# Altium project SM2200_PCB.PrjPCB
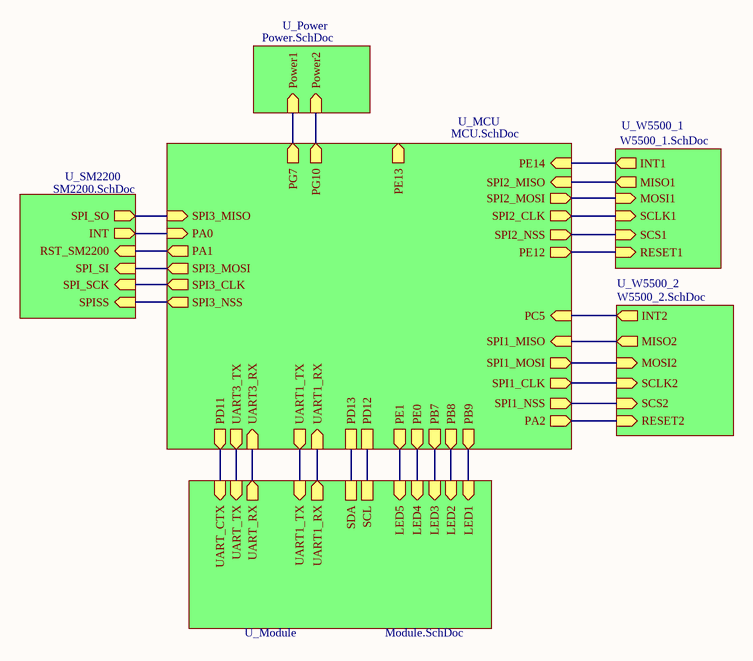
[diagram p0: Top.SchDoc]
7 sheets, 308 parts. Net scope: hierarchical (ports join the sheet entries above them; power ports are global).
Board file: BoardM.PcbDoc
Sheets:
  Top.SchDoc
    U_Module = Module.SchDoc
    U_SM2200 = SM2200.SchDoc
    U_Power = Power.SchDoc
    U_MCU = MCU.SchDoc
    U_W5500_1 = W5500_1.SchDoc
    U_W5500_2 = W5500_2.SchDoc

## Sheet Top.SchDoc
size A4

### Sub-sheets
U_MCU = MCU.SchDoc: SPI1_NSS (out), SPI1_CLK (out), SPI1_MISO (in), SPI1_MOSI (out), SPI2_NSS (out), SPI2_CLK (out), SPI2_MISO (in), SPI2_MOSI (out), PC5 (in), PE14 (in), PE13 (out), PE12 (out), PA2 (out), PA1 (out), PA0 (in), UART1_TX (out), UART1_RX (in), UART3_TX (out), UART3_RX (in), PD11 (out), PD13, PD12, PG7 (out), PG10 (out), PE1 (out), PE0 (out), PB9 (out), PB8 (out), PB7 (out), SPI3_CLK (out), SPI3_MOSI (out), SPI3_NSS (out), SPI3_MISO (in)
U_Module = Module.SchDoc: UART_RX (out), UART_TX (in), UART_CTX (in), SCL, SDA, UART1_TX (in), UART1_RX (out), LED1 (in), LED2 (in), LED3 (in), LED4 (in), LED5 (in)
U_Power = Power.SchDoc: Power1 (in), Power2 (in)
U_SM2200 = SM2200.SchDoc: SPISS (in), SPI_SCK (in), SPI_SI (in), SPI_SO (out), RST_SM2200 (in), INT (out)
U_W5500_1 = W5500_1.SchDoc: RESET1 (in), INT1 (out), SCS1 (in), SCLK1 (in), MOSI1 (in), MISO1 (out)
U_W5500_2 = W5500_2.SchDoc: RESET2 (in), INT2 (out), SCS2 (in), SCLK2 (in), MOSI2 (in), MISO2 (out)

### Nets
INT: sheet U_SM2200/INT, sheet U_MCU/PA0
RST_SM2200: sheet U_SM2200/RST_SM2200, sheet U_MCU/PA1
SPI1_CLK: sheet U_MCU/SPI1_CLK, sheet U_W5500_2/SCLK2
SPI1_MISO: sheet U_MCU/SPI1_MISO, sheet U_W5500_2/MISO2
SPI1_MOSI: sheet U_MCU/SPI1_MOSI, sheet U_W5500_2/MOSI2
SPI1_NSS: sheet U_MCU/SPI1_NSS, sheet U_W5500_2/SCS2
SPI2_CLK: sheet U_MCU/SPI2_CLK, sheet U_W5500_1/SCLK1
SPI2_MISO: sheet U_MCU/SPI2_MISO, sheet U_W5500_1/MISO1
SPI2_MOSI: sheet U_MCU/SPI2_MOSI, sheet U_W5500_1/MOSI1
SPI2_NSS: sheet U_MCU/SPI2_NSS, sheet U_W5500_1/SCS1
SPI3_CLK: sheet U_SM2200/SPI_SCK, sheet U_MCU/SPI3_CLK
SPI3_MISO: sheet U_SM2200/SPI_SO, sheet U_MCU/SPI3_MISO
SPI3_MOSI: sheet U_SM2200/SPI_SI, sheet U_MCU/SPI3_MOSI
SPI3_NSS: sheet U_SM2200/SPISS, sheet U_MCU/SPI3_NSS
NetR11_1: sheet U_MCU/PE14, sheet U_W5500_1/INT1
NetR12_2: sheet U_MCU/PE12, sheet U_W5500_1/RESET1
NetR31_1: sheet U_MCU/PC5, sheet U_W5500_2/INT2
NetR32_2: sheet U_MCU/PA2, sheet U_W5500_2/RESET2
NetR74_2: sheet U_Power/Power2, sheet U_MCU/PG10
NetR75_2: sheet U_Power/Power1, sheet U_MCU/PG7
NetR79_2: sheet U_Module/LED5, sheet U_MCU/PE1
NetR81_1: sheet U_Module/UART1_RX, sheet U_MCU/UART1_RX
NetR82_1: sheet U_Module/UART1_TX, sheet U_MCU/UART1_TX
NetR83_2: sheet U_Module/LED1, sheet U_MCU/PB9
NetR84_2: sheet U_Module/LED2, sheet U_MCU/PB8
NetR85_2: sheet U_Module/LED4, sheet U_MCU/PE0
NetR86_2: sheet U_Module/LED3, sheet U_MCU/PB7
NetR91_1: sheet U_Module/UART_TX, sheet U_MCU/UART3_TX
NetR94_2: sheet U_Module/UART_CTX, sheet U_MCU/PD11
NetR96_2: sheet U_Module/SDA, sheet U_MCU/PD13
NetR98_1: sheet U_Module/UART_RX, sheet U_MCU/UART3_RX
NetR100_2: sheet U_Module/SCL, sheet U_MCU/PD12

## Sheet Module.SchDoc
size A4
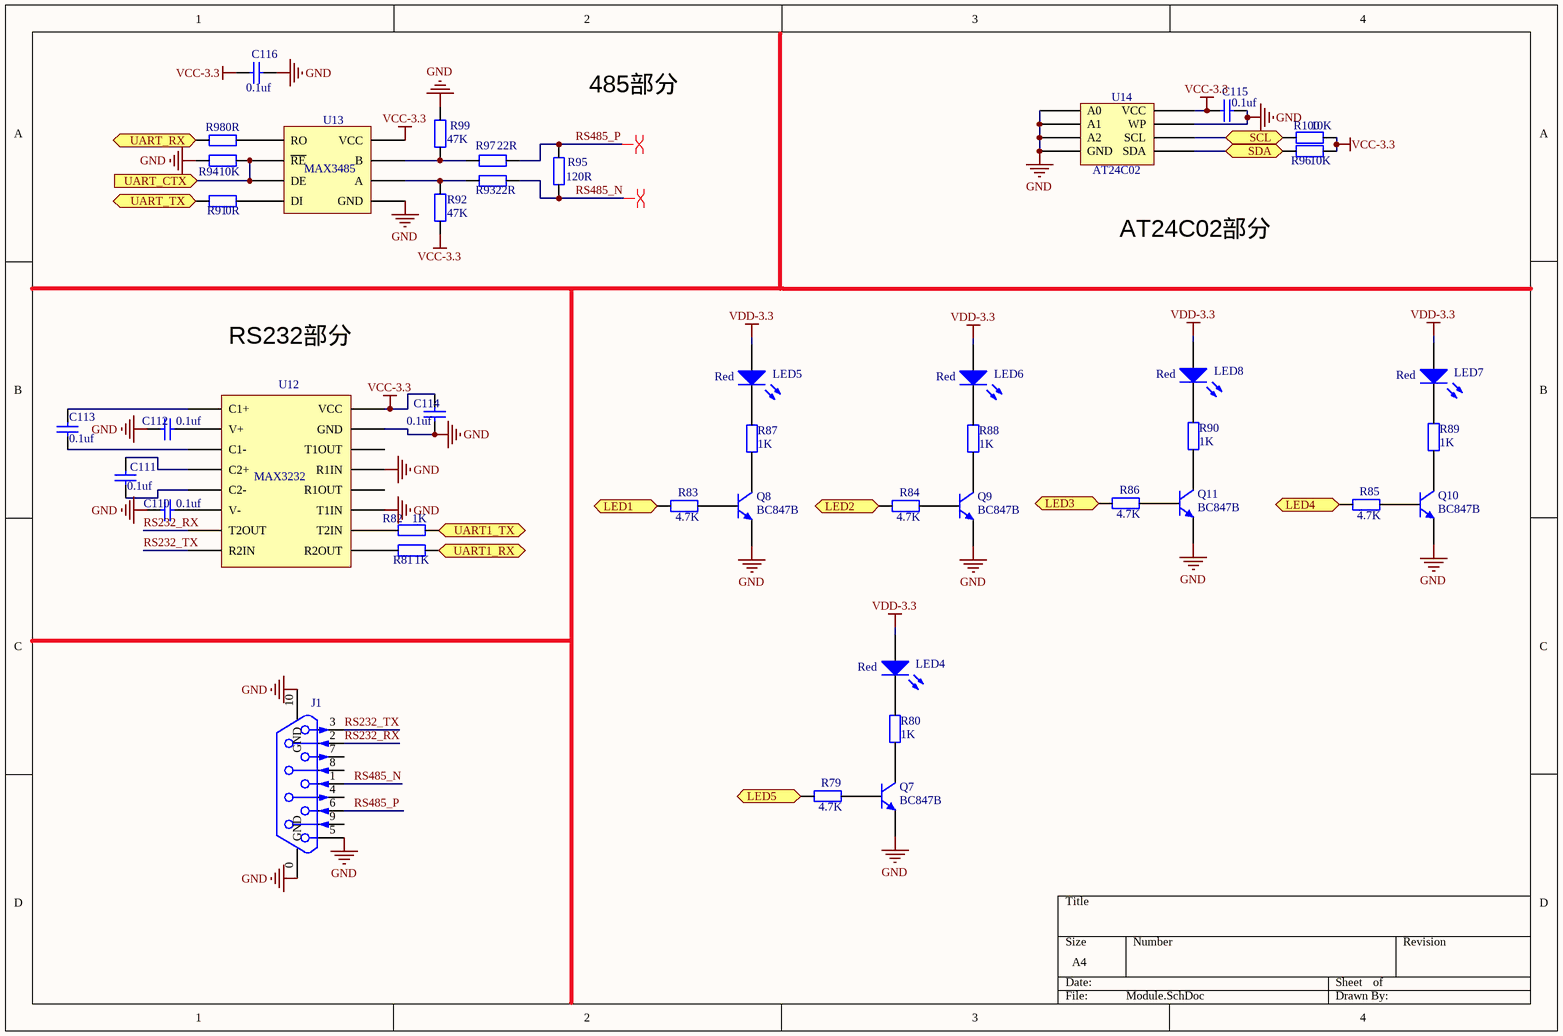
[diagram p1: Module.SchDoc]

### Parts
C110  value 0.1uf  [0603]  (hidden comment: Capacitor-0603)
C111  value 0.1uf  [0603]  (hidden comment: Capacitor-0603)
C112  value 0.1uf  [0603]  (hidden comment: Capacitor-0603)
C113  value 0.1uf  [0603]  (hidden comment: Capacitor-0603)
C114  value 0.1uf  [0603]  (hidden comment: Capacitor-0603)
C115  value 0.1uf  [0603]  (hidden comment: Capacitor-0603)
C116  value 0.1uf  [0603]  (hidden comment: Capacitor-0603)
J1  DB9  [DB9]  (value not drawn)
LED4  Color: Red  [外插小灯]  (hidden comment: LED)
LED5  Color: Red  [外插小灯]  (hidden comment: LED)
LED6  Color: Red  [外插小灯]  (hidden comment: LED)
LED7  Color: Red  [外插小灯]  (hidden comment: LED)
LED8  Color: Red  [外插小灯]  (hidden comment: LED)
Q7  BC847  [BC847B]  (value not drawn)
Q8  BC847  [BC847B]  (value not drawn)
Q9  BC847  [BC847B]  (value not drawn)
Q10  BC847  [BC847B]  (value not drawn)
Q11  BC847  [BC847B]  (value not drawn)
R79  value 4.7K  [0603]  (hidden comment: Resistor-0603)
R80  value 1K  [0603]  (hidden comment: Resistor-0603)
R81  value 1K  [0603]  (hidden comment: Resistor-0603)
R82  value 1K  [0603]  (hidden comment: Resistor-0603)
R83  value 4.7K  [0603]  (hidden comment: Resistor-0603)
R84  value 4.7K  [0603]  (hidden comment: Resistor-0603)
R85  value 4.7K  [0603]  (hidden comment: Resistor-0603)
R86  value 4.7K  [0603]  (hidden comment: Resistor-0603)
R87  value 1K  [0603]  (hidden comment: Resistor-0603)
R88  value 1K  [0603]  (hidden comment: Resistor-0603)
R89  value 1K  [0603]  (hidden comment: Resistor-0603)
R90  value 1K  [0603]  (hidden comment: Resistor-0603)
R91  value 0R  [0603]  (hidden comment: Resistor-0603)
R92  value 47K  [0603]  (hidden comment: Resistor-0603)
R93  value 22R  [0603]  (hidden comment: Resistor-0603)
R94  value 10K  [0603]  (hidden comment: Resistor-0603)
R95  value 120R  [0603]  (hidden comment: Resistor-0603)
R96  value 10K  [0603]  (hidden comment: Resistor-0603)
R97  value 22R  [0603]  (hidden comment: Resistor-0603)
R98  value 0R  [0603]  (hidden comment: Resistor-0603)
R99  value 47K  [0603]  (hidden comment: Resistor-0603)
R100  value 10K  [0603]  (hidden comment: Resistor-0603)
U12  MAX3232  [MAX3232]
U13  MAX3485  [MAX3485]
U14  AT24C02  [AT24C02]

### Ports
LED1 (in), LED2 (in), LED3 (in), LED4 (in), LED5 (in), SCL, SDA, UART1_RX (out), UART1_TX (in), UART_CTX (in), UART_RX (out), UART_TX (in)

### Nets
GND: C110.2 C112.2 C114.1 C115.1 C116.2 J1.0(GND) J1.5 J1.10(GND) Q7.1(E) Q8.1(E) Q9.1(E) Q10.1(E) Q11.1(E) R94.1 R99.2 U12.11(T1IN) U12.13(R1IN) U12.15(GND) U13.5(GND) U14.1(A0) U14.2(A1) U14.3(A2) U14.4(GND) U14.7(WP)
VCC-3.3: C114.2 C115.2 C116.1 R92.1 R96.1 R100.1 U12.16(VCC) U13.8(VCC) U14.8(VCC)
VDD-3.3: LED4.1(A) LED5.1(A) LED6.1(A) LED7.1(A) LED8.1(A)
RS232_RX: J1.2 U12.7(T2OUT)
RS232_TX: J1.3 U12.8(R2IN)
RS485_N: J1.1 R93.1 R95.2
RS485_P: J1.6 R95.1 R97.1
NetC110_1: C110.1 U12.6(V-)
NetC111_1: C111.1 U12.5(C2-)
NetC111_2: C111.2 U12.4(C2+)
NetC112_1: C112.1 U12.2(V+)
NetC113_1: C113.1 U12.3(C1-)
NetC113_2: C113.2 U12.1(C1+)
NetLED4_2: LED4.2 R80.2
NetLED5_2: LED5.2 R87.2
NetLED6_2: LED6.2 R88.2
NetLED7_2: LED7.2 R89.2
NetLED8_2: LED8.2 R90.2
NetQ7_2: Q7.2(B) R79.1
NetQ7_3: Q7.3(C) R80.1
NetQ8_2: Q8.2(B) R83.1
NetQ8_3: Q8.3(C) R87.1
NetQ9_2: Q9.2(B) R84.1
NetQ9_3: Q9.3(C) R88.1
NetQ10_2: Q10.2(B) R85.1
NetQ10_3: Q10.3(C) R89.1
NetQ11_2: Q11.2(B) R86.1
NetQ11_3: Q11.3(C) R90.1
NetR79_2: R79.2 ; port LED5
NetR81_1: R81.1 ; port UART1_RX
NetR81_2: R81.2 U12.9(R2OUT)
NetR82_1: R82.1 ; port UART1_TX
NetR82_2: R82.2 U12.10(T2IN)
NetR83_2: R83.2 ; port LED1
NetR84_2: R84.2 ; port LED2
NetR85_2: R85.2 ; port LED4
NetR86_2: R86.2 ; port LED3
NetR91_1: R91.1 ; port UART_TX
NetR91_2: R91.2 U13.4(DI)
NetR92_2: R92.2 R93.2 U13.6(A)
NetR94_2: R94.2 U13.2(~{RE}) U13.3(DE) ; port UART_CTX
NetR96_2: R96.2 U14.5(SDA) ; port SDA
NetR97_2: R97.2 R99.1 U13.7(B)
NetR98_1: R98.1 ; port UART_RX
NetR98_2: R98.2 U13.1(RO)
NetR100_2: R100.2 U14.6(SCL) ; port SCL

Not connected (* = marked no-connect by the designer): J1 4 7 8 9; U12 12(R1OUT) 14(T1OUT)

### Layout directives
differential pair: RS485_N, RS485_P

### Notes on the sheet
- 485部分
- AT24C02部分
- RS232部分

### Library data of the parts
LED4-LED8 = LED: Value: LED
Q7-Q11 = BC847: Name: BC847B
U12 = MAX3232: Name: MAX3232
U13 = MAX3485: Name: MAX3485
U14 = AT24C02: Name: AT24C02

## Sheet SM2200.SchDoc
size 406 x 228 mm
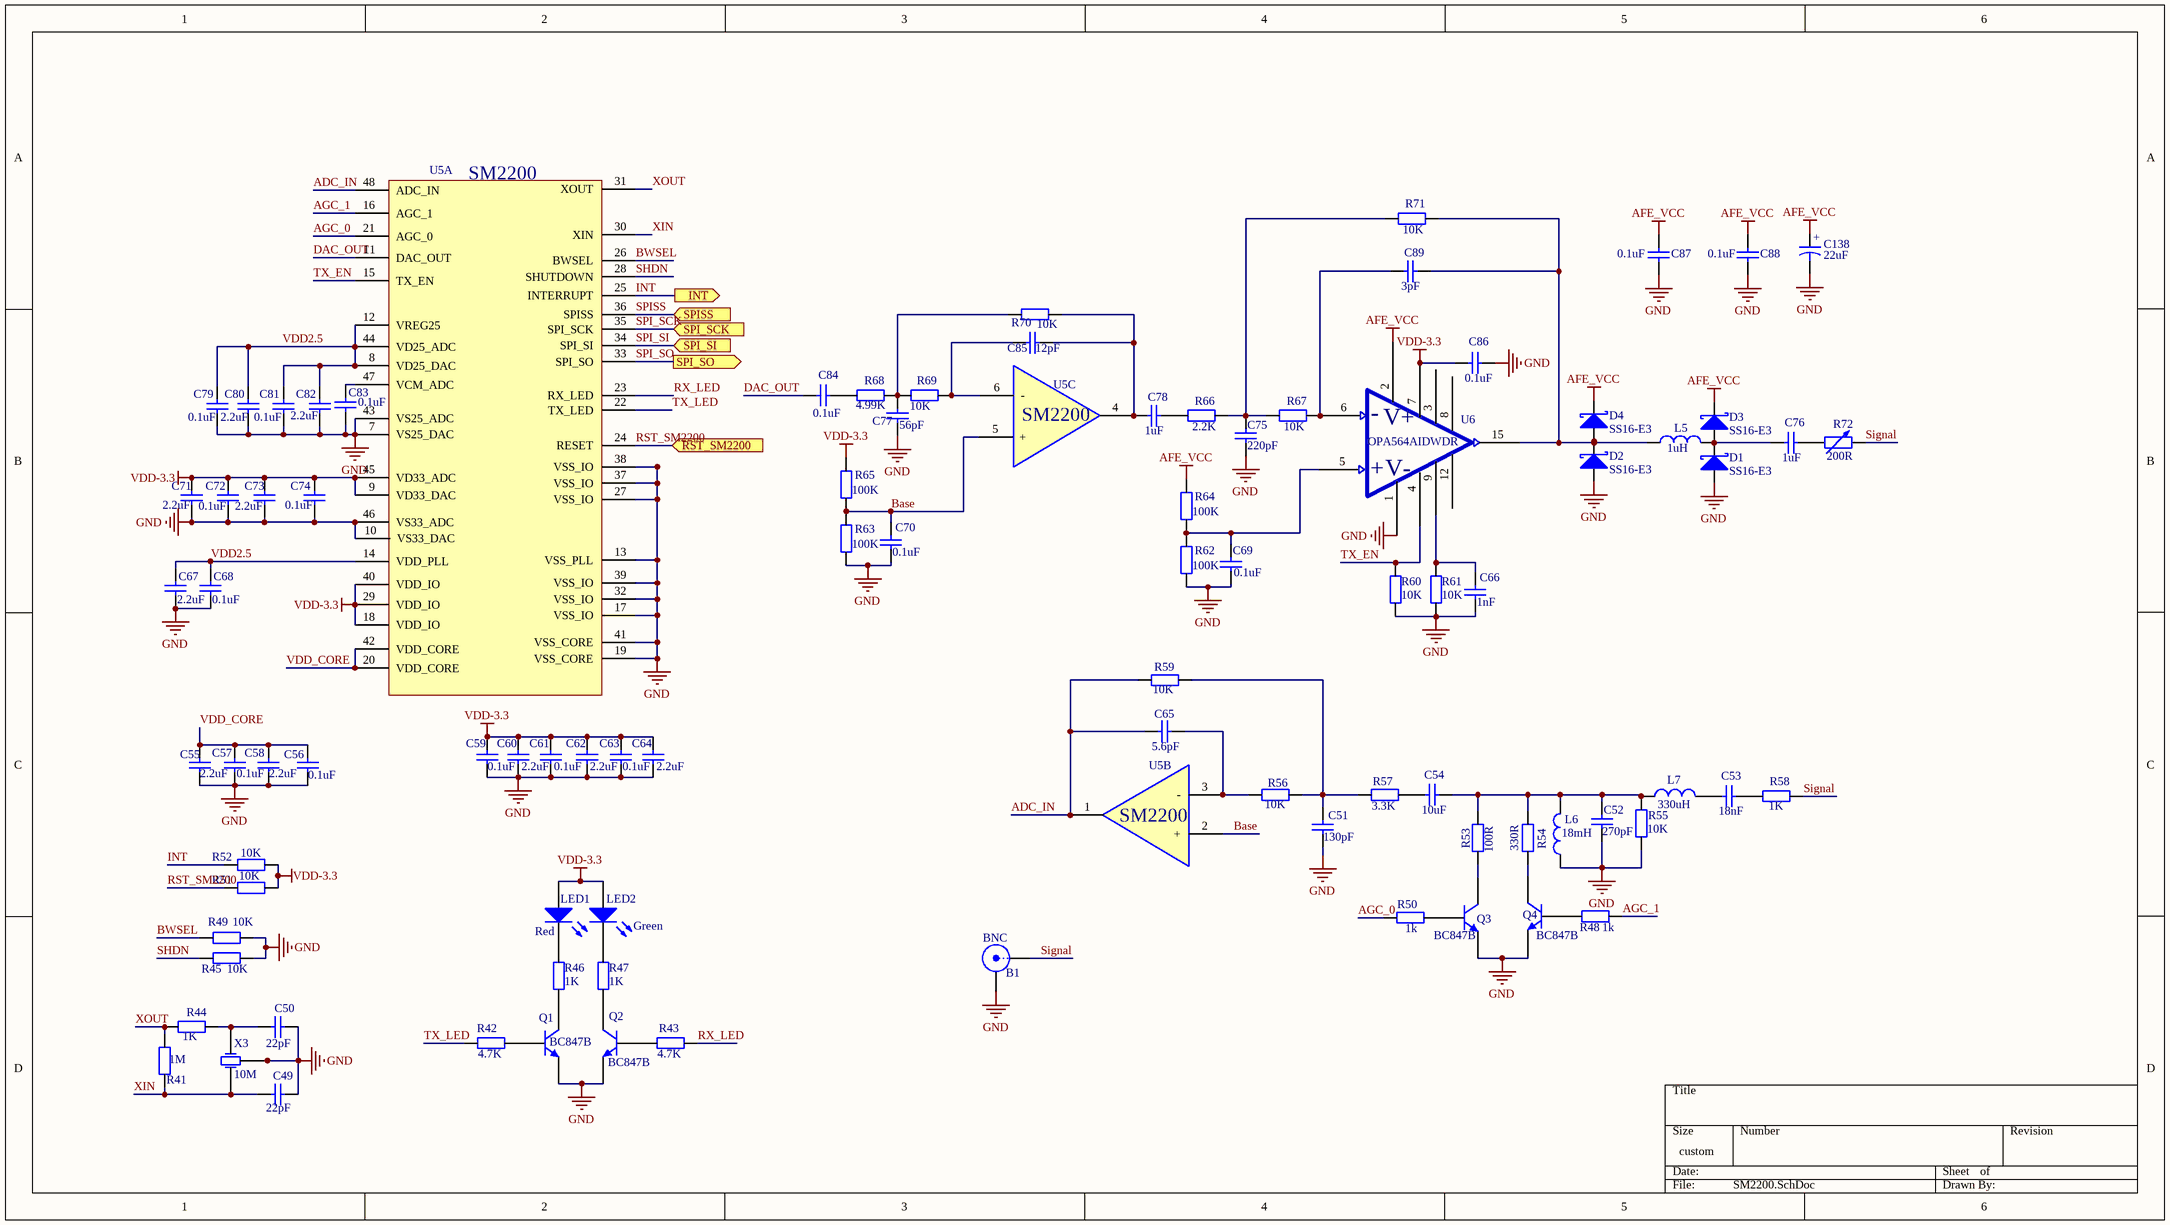
[diagram p2: SM2200.SchDoc]

### Parts
B1  BNC  [BNC]
C49  value 22pF  [0603]  (hidden comment: Capacitor-0805)
C50  value 22pF  [0603]  (hidden comment: Capacitor-0805)
C51  value 130pF  [0603]  (hidden comment: Capacitor-0603)
C52  value 270pF  [0603]  (hidden comment: Capacitor-0603)
C53  value 18nF  [0603]  (hidden comment: Capacitor-0603)
C54  value 10uF  [0805]  (hidden comment: Capacitor-0603)
C55  value 2.2uF  [0603]  (hidden comment: Capacitor-0805)
C56  value 0.1uF  [0603]  (hidden comment: Capacitor-0805)
C57  value 0.1uF  [0603]  (hidden comment: Capacitor-0805)
C58  value 2.2uF  [0603]  (hidden comment: Capacitor-0805)
C59  value 0.1uF  [0603]  (hidden comment: Capacitor-0805)
C60  value 2.2uF  [0603]  (hidden comment: Capacitor-0805)
C61  value 0.1uF  [0603]  (hidden comment: Capacitor-0805)
C62  value 2.2uF  [0603]  (hidden comment: Capacitor-0805)
C63  value 0.1uF  [0603]  (hidden comment: Capacitor-0805)
C64  value 2.2uF  [0603]  (hidden comment: Capacitor-0805)
C65  value 5.6pF  [0603]  (hidden comment: Capacitor-0603)
C66  value 1nF  [0603]  (hidden comment: Capacitor-0603)
C67  value 2.2uF  [0603]  (hidden comment: Capacitor-0805)
C68  value 0.1uF  [0603]  (hidden comment: Capacitor-0805)
C69  value 0.1uF  [0603]  (hidden comment: Capacitor-0603)
C70  value 0.1uF  [0603]  (hidden comment: Capacitor-0603)
C71  value 2.2uF  [0603]  (hidden comment: Capacitor-0805)
C72  value 0.1uF  [0603]  (hidden comment: Capacitor-0805)
C73  value 2.2uF  [0603]  (hidden comment: Capacitor-0805)
C74  value 0.1uF  [0603]  (hidden comment: Capacitor-0805)
C75  value 220pF  [0603]  (hidden comment: Capacitor-0603)
C76  value 1uF  [0603]  (hidden comment: Capacitor-0603)
C77  value 56pF  [0603]  (hidden comment: Capacitor-0603)
C78  value 1uF  [0603]  (hidden comment: Capacitor-0603)
C79  value 0.1uF  [0603]  (hidden comment: Capacitor-0805)
C80  value 2.2uF  [0603]  (hidden comment: Capacitor-0805)
C81  value 0.1uF  [0603]  (hidden comment: Capacitor-0805)
C82  value 2.2uF  [0603]  (hidden comment: Capacitor-0805)
C83  value 0.1uF  [0603]  (hidden comment: Capacitor-0805)
C84  value 0.1uF  [0603]  (hidden comment: Capacitor-0603)
C85  value 12pF  [0603]  (hidden comment: Capacitor-0603)
C86  value 0.1uF  [0603]  (hidden comment: Capacitor-0603)
C87  value 0.1uF  [0603]  (hidden comment: Capacitor-0603)
C88  value 0.1uF  [0603]  (hidden comment: Capacitor-0603)
C89  value 3pF  [0603]  (hidden comment: Capacitor-0603)
C138  value 22uF  [3528]  (hidden comment: 电解电容)
D1  Name: SS16-E3  [IN5824]  (hidden comment: SSA34)
D2  Name: SS16-E3  [IN5824]  (hidden comment: SSA34)
D3  Name: SS16-E3  [IN5824]  (hidden comment: SSA34)
D4  Name: SS16-E3  [IN5824]  (hidden comment: SSA34)
L5  value 1uH  [1206]  (hidden comment: Inductor)
L6  value 18mH  [工字电感0608]  (hidden comment: Inductor)
L7  value 330uH  [Inductor(7.8*7*5)]  (hidden comment: Inductor)
LED1  Color: Red  [外插小灯]  (hidden comment: LED)
LED2  Color: Green  [外插小灯]  (hidden comment: LED)
Q1  BC847  [BC847B]  (value not drawn)
Q2  BC847  [BC847B]  (value not drawn)
Q3  BC847  [BC847B]  (value not drawn)
Q4  BC847  [BC847B]  (value not drawn)
R41  value 1M  [0603]  (hidden comment: Resistor-0805)
R42  value 4.7K  [0603]  (hidden comment: Resistor-0805)
R43  value 4.7K  [0603]  (hidden comment: Resistor-0805)
R44  value 1K  [0603]  (hidden comment: Resistor-0805)
R45  value 10K  [0603]  (hidden comment: Resistor-0805)
R46  value 1K  [0603]  (hidden comment: Resistor-0805)
R47  value 1K  [0603]  (hidden comment: Resistor-0805)
R48  value 1k  [0603]  (hidden comment: Resistor-0603)
R49  value 10K  [0603]  (hidden comment: Resistor-0805)
R50  value 1k  [0603]  (hidden comment: Resistor-0603)
R51  value 10K  [0603]  (hidden comment: Resistor-0805)
R52  value 10K  [0603]  (hidden comment: Resistor-0805)
R53  value 100R  [0603]  (hidden comment: Resistor-0603)
R54  value 330R  [0603]  (hidden comment: Resistor-0603)
R55  value 10K  [0603]  (hidden comment: Resistor-0603)
R56  value 10K  [0603]  (hidden comment: Resistor-0603)
R57  value 3.3K  [0603]  (hidden comment: Resistor-0603)
R58  value 1K  [0603]  (hidden comment: Resistor-0603)
R59  value 10K  [0603]  (hidden comment: Resistor-0603)
R60  value 10K  [0603]  (hidden comment: Resistor-0603)
R61  value 10K  [0603]  (hidden comment: Resistor-0603)
R62  value 100K  [0603]  (hidden comment: Resistor-0603)
R63  value 100K  [0603]  (hidden comment: Resistor-0603)
R64  value 100K  [0603]  (hidden comment: Resistor-0603)
R65  value 100K  [0603]  (hidden comment: Resistor-0603)
R66  value 2.2K  [0603]  (hidden comment: Resistor-0603)
R67  value 10K  [0603]  (hidden comment: Resistor-0603)
R68  value 4.99K  [0603]  (hidden comment: Resistor-0603)
R69  value 10K  [0603]  (hidden comment: Resistor-0603)
R70  value 10K  [0603]  (hidden comment: Resistor-0603)
R71  value 10K  [0603]  (hidden comment: Resistor-0603)
R72  value 200R  [3296电位器]  (hidden comment: Res_)
U5  SM2200  [SM2200]  (parts A,B,C of 3)
U6  OPA564AIDWDR  [OPA564AIDWDR]
X3  value 10M  [3225无源晶振]  (hidden comment: 3225无源晶振)

### Ports
INT (out), RST_SM2200 (in), SPI_SCK (in), SPI_SI (in), SPI_SO (out), SPISS (in)

### Nets
AFE_VCC: C87.2 C88.2 C138.2 D3.2(K) D4.2(K) R64.2 U6.2
GND: B1.1(Y) C49.2 C50.2 C51.2 C52.2 C55.1 C56.1 C57.1 C58.1 C59.1 C60.1 C61.1 C62.1 C63.1 C64.1 C66.1 C67.1 C68.1 C69.2 C70.1 C71.1 C72.1 C73.1 C74.1 C75.2 C77.1 C79.1 C80.1 C81.1 C82.1 C83.1 C86.1 C87.1 C88.1 C138.1 D1.1(A) D2.1(A) L6.1 Q1.1(E) Q2.1(E) Q3.1(E) Q4.1(E) R45.2 R49.2 R55.1 R60.1 R61.1 R62.1 R63.1 U5.7(VS25_DAC) U5.10(VS33_DAC) U5.13(VSS_PLL) U5.17(VSS_IO) U5.19(VSS_CORE) U5.27(VSS_IO) U5.32(VSS_IO) U5.37(VSS_IO) U5.38(VSS_IO) U5.39(VSS_IO) U5.41(VSS_CORE) U5.43(VS25_ADC) U5.46(VS33_ADC) U6.1 X3.2(GND) X3.4(GND)
VDD-3.3: C59.2 C60.2 C61.2 C62.2 C63.2 C64.2 C71.2 C72.2 C73.2 C74.2 C86.2 LED1.1(A) LED2.1(A) R51.2 R52.2 R65.2 U5.9(VD33_DAC) U5.18(VDD_IO) U5.29(VDD_IO) U5.40(VDD_IO) U5.45(VD33_ADC) U6.7
ADC_IN: C65.1 R59.2 U5.1 U5.48(ADC_IN)
AGC_0: R50.2 U5.21(AGC_0)
AGC_1: R48.2 U5.16(AGC_1)
Base: C70.2 R63.2 R65.1 U5.2(+) U5.5(+)
BWSEL: R49.1 U5.26(BWSEL)
DAC_OUT: C84.2 U5.11(DAC_OUT)
INT: R52.1 U5.25(INTERRUPT) ; port INT
RST_SM2200: R51.1 U5.24(RESET) ; port RST_SM2200
RX_LED: R43.1 U5.23(RX_LED)
SHDN: R45.1 U5.28(SHUTDOWN)
Signal: B1.2(X) R58.2 R72.2
SPI_SCK: U5.35(SPI_SCK) ; port SPI_SCK  [project net SPI3_CLK]
SPI_SI: U5.34(SPI_SI) ; port SPI_SI  [project net SPI3_MOSI]
SPI_SO: U5.33(SPI_SO) ; port SPI_SO  [project net SPI3_MISO]
SPISS: U5.36(SPISS) ; port SPISS  [project net SPI3_NSS]
TX_EN: R60.2 U5.15(TX_EN) U6.4
TX_LED: R42.2 U5.22(TX_LED)
VDD2.5: C67.2 C68.2 C79.2 C80.2 C81.2 C82.2 U5.8(VD25_DAC) U5.12(VREG25) U5.14(VDD_PLL) U5.44(VD25_ADC)
VDD_CORE: C55.2 C56.2 C57.2 C58.2 U5.20(VDD_CORE) U5.42(VDD_CORE)
XIN: C49.1 R41.1 U5.30(XIN) X3.1(OSC1)
XOUT: R41.2 R44.1 U5.31(XOUT)
NetC50_1: C50.1 R44.2 X3.3(OSC2)
NetC51_1: C51.1 R56.1 R57.2 R59.1
NetC52_1: C52.1 C54.1 L6.2 L7.1 R53.2 R54.2 R55.2
NetC53_1: C53.1 R58.1
NetC53_2: C53.2 L7.2
NetC54_2: C54.2 R57.1
NetC65_2: C65.2 R56.2 U5.3(-)
NetC66_2: C66.2 R61.2 U6.9
NetC69_1: C69.1 R62.2 R64.1 U6.5
NetC75_1: C75.1 R66.2 R67.1 R71.1
NetC76_1: C76.1 R72.1
NetC76_2: C76.2 D1.2(K) D3.1(A) L5.2
NetC77_2: C77.2 R68.2 R69.1 R70.1
NetC78_1: C78.1 R66.1
NetC78_2: C78.2 C85.1 R70.2 U5.4
NetC83_2: C83.2 U5.47(VCM_ADC)
NetC84_1: C84.1 R68.1
NetC85_2: C85.2 R69.2 U5.6(-)
NetC89_1: C89.1 D2.2(K) D4.1(A) L5.1 R71.2 U6.15
NetC89_2: C89.2 R67.2 U6.6
NetLED1_2: LED1.2 R46.2
NetLED2_2: LED2.2 R47.2
NetQ1_2: Q1.2(B) R42.1
NetQ1_3: Q1.3(C) R46.1
NetQ2_2: Q2.2(B) R43.2
NetQ2_3: Q2.3(C) R47.1
NetQ3_2: Q3.2(B) R50.1
NetQ3_3: Q3.3(C) R53.1
NetQ4_2: Q4.2(B) R48.1
NetQ4_3: Q4.3(C) R54.1

Not connected (* = marked no-connect by the designer): U6 3 8 12

### Notes on the sheet
- (in symbol OPA564AIDWDR) -; V+; +; V-
- (in symbol 电解电容) +

### Library data of the parts
C49 C50 C55-C64 C67 C68 C71-C74 C79-C83 = Capacito
R41-R47 R49 R51 R52 = Resisto
U6 = OPA564AIDWDR: pin to pad: 1>1+10+11+20+13+14; Name: OPA564AIDWDR
B1 = BNC: Name: BNC
LED1 LED2 = LED: Value: LED
Q1-Q4 = BC847: Name: BC847B
R72 = Res_: Name: 3296电位器

## Sheet Power.SchDoc
size A4
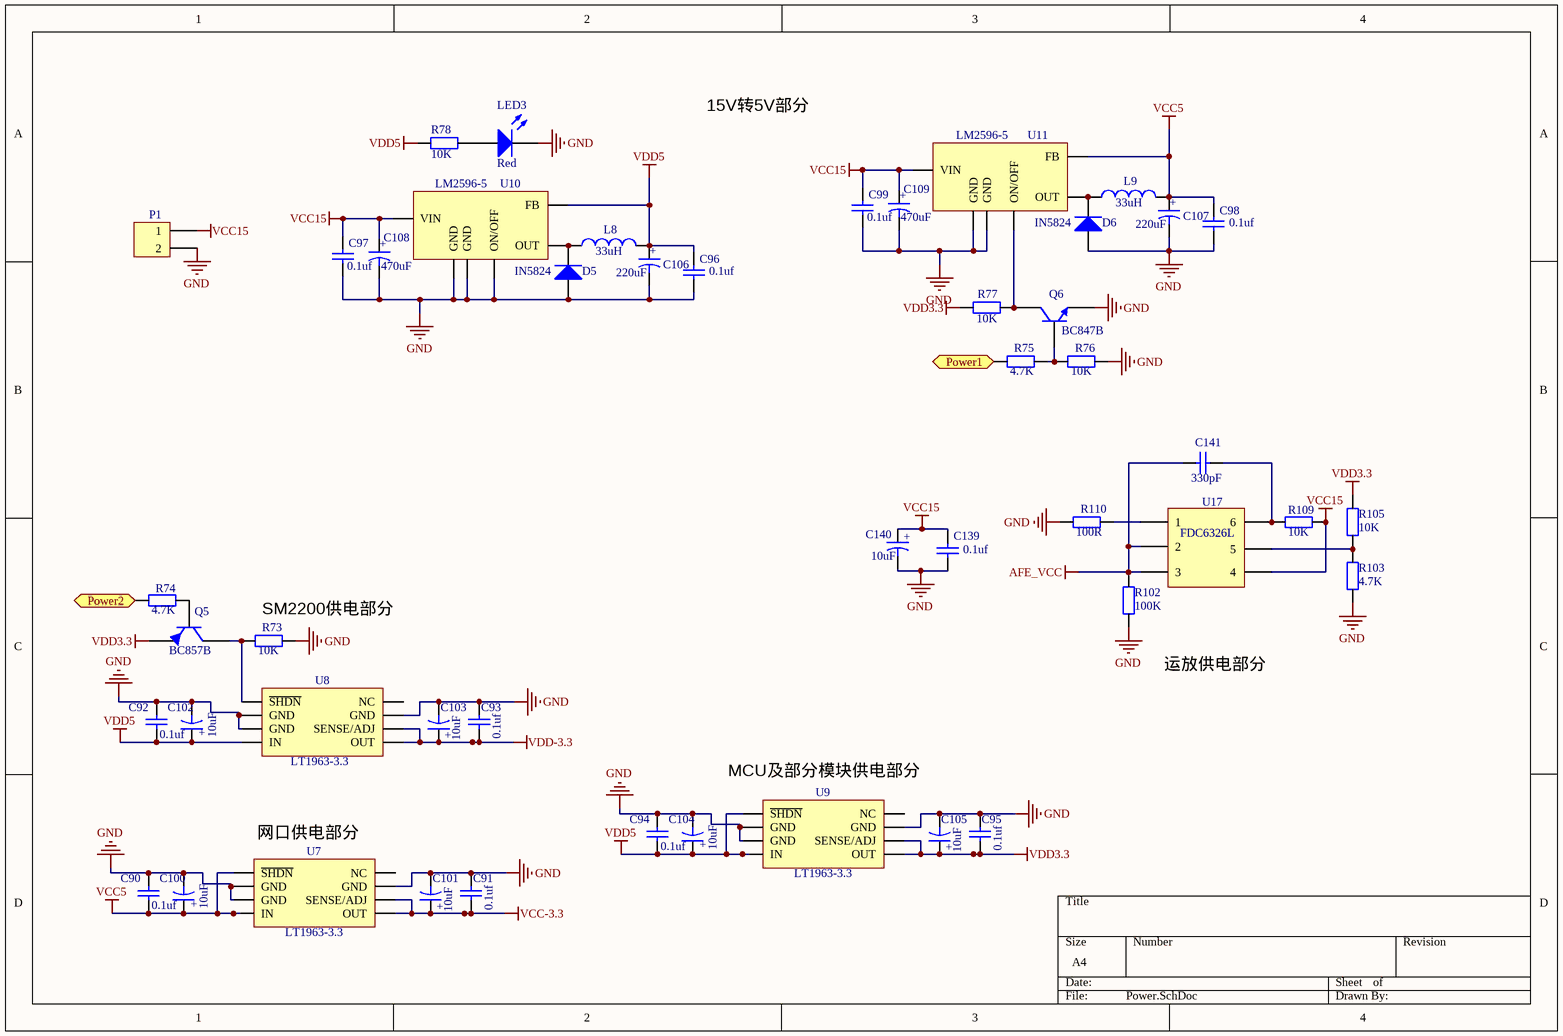
[diagram p3: Power.SchDoc]

### Parts
C90  value 0.1uf  [0805]  (hidden comment: Capacitor-0805)
C91  value 0.1uf  [0805]  (hidden comment: Capacitor-0805)
C92  value 0.1uf  [0805]  (hidden comment: Capacitor-0805)
C93  value 0.1uf  [0805]  (hidden comment: Capacitor-0805)
C94  value 0.1uf  [0805]  (hidden comment: Capacitor-0805)
C95  value 0.1uf  [0805]  (hidden comment: Capacitor-0805)
C96  value 0.1uf  [0805]  (hidden comment: Capacitor-0805)
C97  value 0.1uf  [0805]  (hidden comment: Capacitor-0805)
C98  value 0.1uf  [0805]  (hidden comment: Capacitor-0805)
C99  value 0.1uf  [0805]  (hidden comment: Capacitor-0805)
C100  value 10uF  [钽电容1206（A3216）]  (hidden comment: 电解电容)
C101  value 10uF  [钽电容1206（A3216）]  (hidden comment: 电解电容)
C102  value 10uF  [钽电容1206（A3216）]  (hidden comment: 电解电容)
C103  value 10uF  [钽电容1206（A3216）]  (hidden comment: 电解电容)
C104  value 10uF  [钽电容1206（A3216）]  (hidden comment: 电解电容)
C105  value 10uF  [钽电容1206（A3216）]  (hidden comment: 电解电容)
C106  value 220uF  [贴片铝电容-8*10.3]  (hidden comment: 电解电容)
C107  value 220uF  [贴片铝电容-8*10.3]  (hidden comment: 电解电容)
C108  value 470uF  [贴片铝电容-10*10]  (hidden comment: 电解电容)
C109  value 470uF  [贴片铝电容-10*10]  (hidden comment: 电解电容)
C139  value 0.1uf  [0805]  (hidden comment: Capacitor-0805)
C140  value 10uF  [3528]  (hidden comment: 电解电容)
C141  value 330pF  [0603]  (hidden comment: Capacitor-0805)
D5  IN5824  [IN5824]
D6  IN5824  [IN5824]
L8  value 33uH  [SLF6025   电感]  (hidden comment: Inductor)
L9  value 33uH  [SLF6025   电感]  (hidden comment: Inductor)
LED3  Color: Red  [外插小灯]  (hidden comment: LED)
P1  端子2  [MOLEX-2]  (value not drawn)
Q5  Name: BC857B  [BC847B]  (hidden comment: BC587B)
Q6  BC847  [BC847B]  (value not drawn)
R73  value 10K  [0603]  (hidden comment: Resistor-0603)
R74  value 4.7K  [0603]  (hidden comment: Resistor-0603)
R75  value 4.7K  [0603]  (hidden comment: Resistor-0603)
R76  value 10K  [0603]  (hidden comment: Resistor-0603)
R77  value 10K  [0603]  (hidden comment: Resistor-0603)
R78  value 10K  [0603]  (hidden comment: Resistor-0603)
R102  value 100K  [0603]  (hidden comment: Resistor-0603)
R103  value 4.7K  [0603]  (hidden comment: Resistor-0603)
R105  value 10K  [0603]  (hidden comment: Resistor-0603)
R109  value 10K  [0603]  (hidden comment: Resistor-0603)
R110  value 100R  [0603]  (hidden comment: Resistor-0603)
U7  LT1963  [LT1963]  (value not drawn)
U8  LT1963  [LT1963]  (value not drawn)
U9  LT1963  [LT1963]  (value not drawn)
U10  LM2596  [LM2596]  (value not drawn)
U11  LM2596  [LM2596]  (value not drawn)
U17  FDC6326L  [FDC6326L]

### Ports
Power1 (in), Power2 (in)

### Nets
AFE_VCC: C141.2 R102.2 U17.2 U17.3
GND: C90.2 C91.2 C92.2 C93.2 C94.2 C95.2 C96.1 C97.1 C98.1 C99.1 C100.1 C101.1 C102.1 C103.1 C104.1 C105.1 C106.1 C107.1 C108.1 C109.1 C139.1 C140.1 D5.1(A) D6.1(A) LED3.2 P1.2 Q6.1(E) R73.1 R76.1 R102.1 R103.1 R110.1 U7.3(GND) U7.6(GND) U7.7(GND) U8.3(GND) U8.6(GND) U8.7(GND) U9.3(GND) U9.6(GND) U9.7(GND) U10.3(GND) U10.5(ON/OFF) U10.6(GND) U11.3(GND) U11.6(GND)
VCC5: C90.1 C98.2 C100.2 C107.2 L9.2 U7.5(~{SHDN}) U7.8(IN) U11.4(FB)
VCC15: C97.2 C99.2 C108.2 C109.2 C139.2 C140.2 P1.1 R109.1 U10.1(VIN) U11.1(VIN) U17.4
VCC-3.3: C91.1 C101.2 U7.1(OUT) U7.2(SENSE/ADJ)
VDD3.3: C95.1 C105.2 Q5.1(E) R77.1 R105.2 U9.1(OUT) U9.2(SENSE/ADJ)
VDD5: C92.1 C94.1 C96.2 C102.2 C104.2 C106.2 L8.2 R78.2 U8.8(IN) U9.5(~{SHDN}) U9.8(IN) U10.4(FB)
VDD-3.3: C93.1 C103.2 U8.1(OUT) U8.2(SENSE/ADJ)
NetC141_1: C141.1 R109.2 U17.6
NetD5_2: D5.2(K) L8.1 U10.2(OUT)
NetD6_2: D6.2(K) L9.1 U11.2(OUT)
NetLED3_1: LED3.1(A) R78.1
NetQ5_2: Q5.2(B) R74.1
NetQ5_3: Q5.3(C) R73.2 U8.5(~{SHDN})
NetQ6_2: Q6.2(B) R75.1 R76.2
NetQ6_3: Q6.3(C) R77.2 U11.5(ON/OFF)
NetR74_2: R74.2 ; port Power2
NetR75_2: R75.2 ; port Power1
NetR103_2: R103.2 R105.1 U17.5
NetR110_2: R110.2 U17.1

Not connected (* = marked no-connect by the designer): U7 4(NC); U8 4(NC); U9 4(NC)

### Notes on the sheet
- 15V转5V部分
- (near R73) SM2200供电部分
- 运放供电部分
- (near U9) MCU及部分模块供电部分
- (near U7) 网口供电部分
- (in symbol L) LT1963-3.3; LM2596-5
- (in symbol 电解电容) +

### Library data of the parts
C90-C99 C139 C141 = Capacitor
D5 D6 = I
L8 L9 = Ind
U7-U11 = L
LED3 = LED: Value: LED
Q6 = BC847: Name: BC847B
U17 = FDC6326L: Name: FDC6326L

## Sheet MCU.SchDoc
size A4
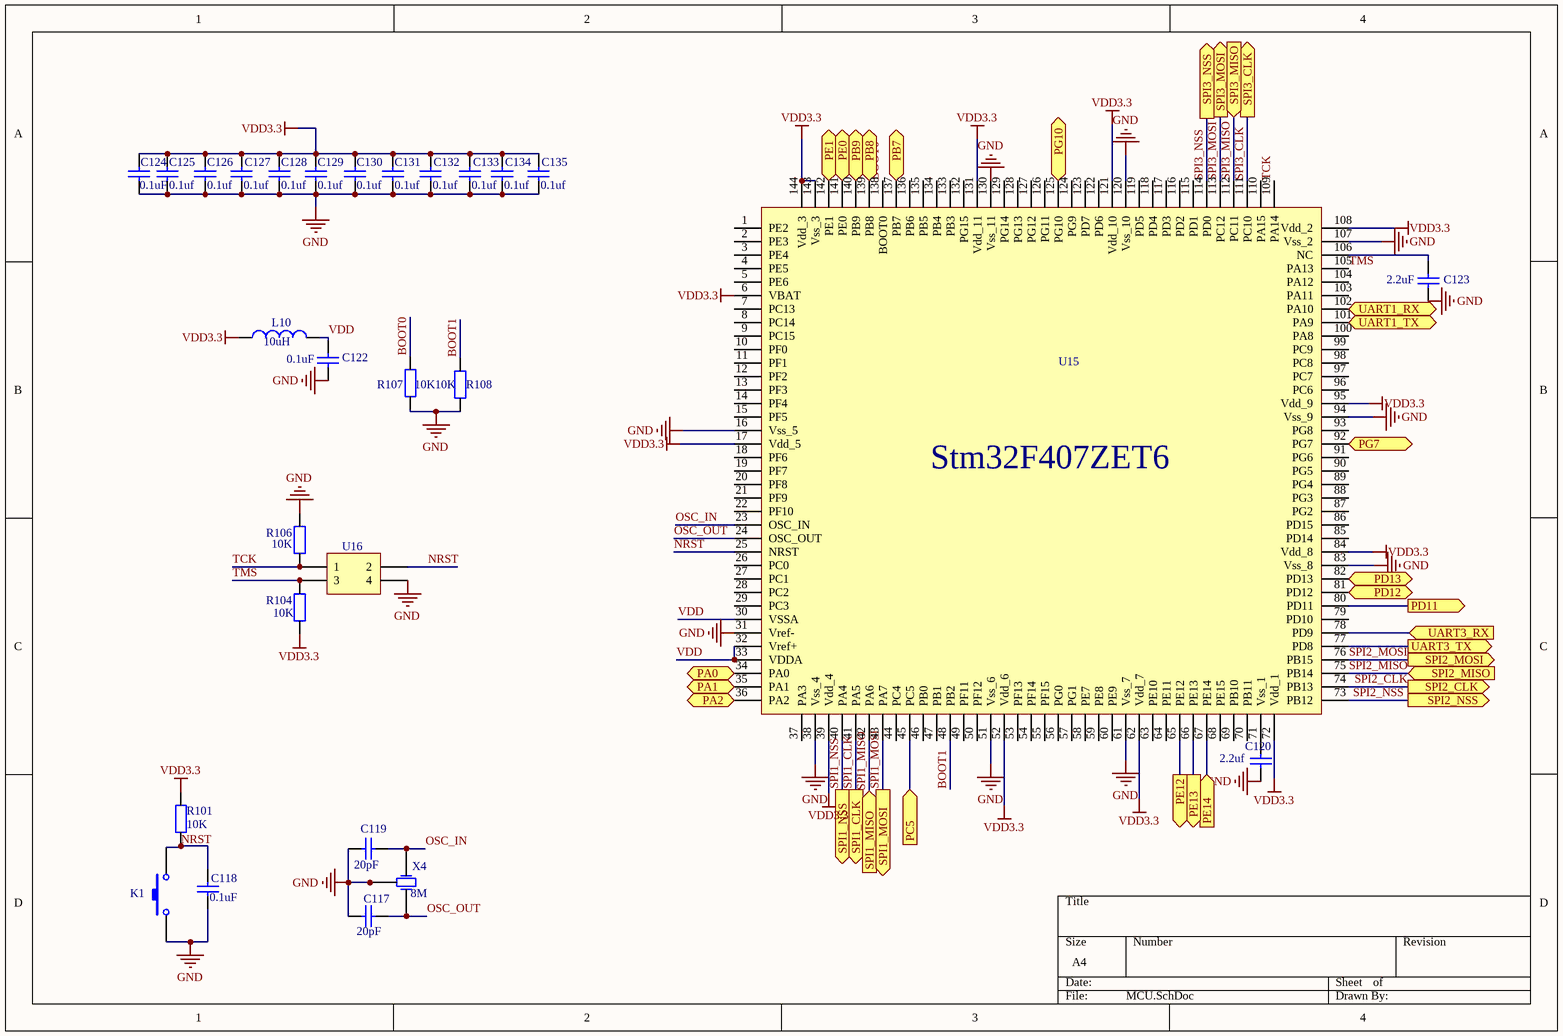
[diagram p4: MCU.SchDoc]

### Parts
C117  value 20pF  [0603]  (hidden comment: Capacitor-0805)
C118  value 0.1uF  [0603]  (hidden comment: Capacitor-0805)
C119  value 20pF  [0603]  (hidden comment: Capacitor-0805)
C120  value 2.2uf  [0603]  (hidden comment: Capacitor-0603)
C122  value 0.1uF  [0603]  (hidden comment: Capacitor-0805)
C123  value 2.2uF  [0603]  (hidden comment: Capacitor-0603)
C124  value 0.1uF  [0603]  (hidden comment: Capacitor-0805)
C125  value 0.1uf  [0603]  (hidden comment: Capacitor-0805)
C126  value 0.1uf  [0603]  (hidden comment: Capacitor-0805)
C127  value 0.1uf  [0603]  (hidden comment: Capacitor-0805)
C128  value 0.1uf  [0603]  (hidden comment: Capacitor-0805)
C129  value 0.1uf  [0603]  (hidden comment: Capacitor-0805)
C130  value 0.1uf  [0603]  (hidden comment: Capacitor-0805)
C131  value 0.1uf  [0603]  (hidden comment: Capacitor-0805)
C132  value 0.1uf  [0603]  (hidden comment: Capacitor-0805)
C133  value 0.1uf  [0603]  (hidden comment: Capacitor-0805)
C134  value 0.1uf  [0603]  (hidden comment: Capacitor-0805)
C135  value 0.1uf  [0603]  (hidden comment: Capacitor-0805)
K1  按键  [贴片按键]  (value not drawn)
L10  value 10uH  [0805]  (hidden comment: Inductor)
R101  value 10K  [0603]  (hidden comment: Resistor-0805)
R104  value 10K  [0603]  (hidden comment: Resistor-0805)
R106  value 10K  [0603]  (hidden comment: Resistor-0805)
R107  value 10K  [0603]  (hidden comment: Resistor-0805)
R108  value 10K  [0603]  (hidden comment: Resistor-0805)
U15  STM32F407ZET6  [Stm32f407ZET6 - duplicate]  (value not drawn)
U16  Header 2X2  [HDR2X2]  (value not drawn)
X4  value 8M  [3225无源晶振]  (hidden comment: 3225无源晶振)

### Ports
PA0 (in), PA1 (out), PA2 (out), PB7 (out), PB8 (out), PB9 (out), PC5 (in), PD11 (out), PD12, PD13, PE0 (out), PE1 (out), PE12 (out), PE13 (out), PE14 (in), PG7 (out), PG10 (out), SPI1_CLK (out), SPI1_MISO (in), SPI1_MOSI (out), SPI1_NSS (out), SPI2_CLK (out), SPI2_MISO (in), SPI2_MOSI (out), SPI2_NSS (out), SPI3_CLK (out), SPI3_MISO (in), SPI3_MOSI (out), SPI3_NSS (out), UART1_RX (in), UART1_TX (out), UART3_RX (in), UART3_TX (out)

### Nets
GND: C117.1 C118.1 C119.1 C120.1 C122.1 C123.1 C124.1 C125.1 C126.1 C127.1 C128.1 C129.1 C130.1 C131.1 C132.1 C133.1 C134.1 C135.1 K1.1 R106.2 R107.1 R108.1 U15.16(Vss_5) U15.31(Vref-) U15.38(Vss_4) U15.51(Vss_6) U15.61(Vss_7) U15.83(Vss_8) U15.94(Vss_9) U15.107(Vss_2) U15.120(Vss_10) U15.130(Vss_11) U16.4 X4.2(GND) X4.4(GND)
VDD3.3: C124.2 C125.2 C126.2 C127.2 C128.2 C129.2 C130.2 C131.2 C132.2 C133.2 C134.2 C135.2 L10.1 R101.2 R104.1 U15.6(VBAT) U15.17(Vdd_5) U15.39(Vdd_4) U15.52(Vdd_6) U15.62(Vdd_7) U15.72(Vdd_1) U15.84(Vdd_8) U15.95(Vdd_9) U15.108(Vdd_2) U15.121(Vdd_10) U15.131(Vdd_11) U15.143(Vss_3) U15.144(Vdd_3)
BOOT0: R107.2 U15.138(BOOT0)
BOOT1: R108.2 U15.48(PB2)
INT: U15.34(PA0) ; port PA0
NRST: C118.2 K1.2 R101.1 U15.25(NRST) U16.2
OSC_IN: C119.2 U15.23(OSC_IN) X4.1(OSC1)
OSC_OUT: C117.2 U15.24(OSC_OUT) X4.3(OSC2)
RST_SM2200: U15.35(PA1) ; port PA1
SPI1_CLK: U15.41(PA5) ; port SPI1_CLK
SPI1_MISO: U15.42(PA6) ; port SPI1_MISO
SPI1_MOSI: U15.43(PA7) ; port SPI1_MOSI
SPI1_NSS: U15.40(PA4) ; port SPI1_NSS
SPI2_CLK: U15.74(PB13) ; port SPI2_CLK
SPI2_MISO: U15.75(PB14) ; port SPI2_MISO
SPI2_MOSI: U15.76(PB15) ; port SPI2_MOSI
SPI2_NSS: U15.73(PB12) ; port SPI2_NSS
SPI3_CLK: U15.111(PC10) ; port SPI3_CLK
SPI3_MISO: U15.112(PC11) ; port SPI3_MISO
SPI3_MOSI: U15.113(PC12) ; port SPI3_MOSI
SPI3_NSS: U15.114(PD0) ; port SPI3_NSS
TCK: R106.1 U15.109(PA14) U16.1
TMS: R104.2 U15.105(PA13) U16.3
VDD: C122.2 L10.2 U15.30(VSSA) U15.32(Vref+) U15.33(VDDA)
NetC120_2: C120.2 U15.71(Vss_1)
NetC123_2: C123.2 U15.106(NC)
NetR11_1: U15.67(PE14) ; port PE14
NetR12_2: U15.65(PE12) ; port PE12
NetR31_1: U15.45(PC5) ; port PC5
NetR32_2: U15.36(PA2) ; port PA2
NetR74_2: U15.125(PG10) ; port PG10
NetR75_2: U15.92(PG7) ; port PG7
NetR79_2: U15.142(PE1) ; port PE1
NetR81_1: U15.102(PA10) ; port UART1_RX
NetR82_1: U15.101(PA9) ; port UART1_TX
NetR83_2: U15.140(PB9) ; port PB9
NetR84_2: U15.139(PB8) ; port PB8
NetR85_2: U15.141(PE0) ; port PE0
NetR86_2: U15.137(PB7) ; port PB7
NetR91_1: U15.77(PD8) ; port UART3_TX
NetR94_2: U15.80(PD11) ; port PD11
NetR96_2: U15.82(PD13) ; port PD13
NetR98_1: U15.78(PD9) ; port UART3_RX
NetR100_2: U15.81(PD12) ; port PD12
NetU15_66: U15.66(PE13) ; port PE13

Not connected (* = marked no-connect by the designer): U15 1(PE2) 2(PE3) 3(PE4) 4(PE5) 5(PE6) 7(PC13) 8(PC14) 9(PC15) 10(PF0) 11(PF1) 12(PF2) 13(PF3) 14(PF4) 15(PF5) 18(PF6) 19(PF7) 20(PF8) 21(PF9) 22(PF10) 26(PC0) 27(PC1) 28(PC2) 29(PC3) 37(PA3) 44(PC4) 46(PB0) 47(PB1) 49(PF11) 50(PF12) 53(PF13) 54(PF14) 55(PF15) 56(PG0) 57(PG1) 58(PE7) 59(PE8) 60(PE9) 63(PE10) 64(PE11) 68(PE15) 69(PB10) 70(PB11) 79(PD10) 85(PD14) 86(PD15) 87(PG2) 88(PG3) 89(PG4) 90(PG5) 91(PG6) 93(PG8) 96(PC6) 97(PC7) 98(PC8) 99(PC9) 100(PA8) 103(PA11) 104(PA12) 110(PA15) 115(PD1) 116(PD2) 117(PD3) 118(PD4) 119(PD5) 122(PD6) 123(PD7) 124(PG9) 126(PG11) 127(PG12) 128(PG13) 129(PG14) 132(PG15) 133(PB3) 134(PB4) 135(PB5) 136(PB6)

### Notes on the sheet
- (in symbol STM32F407Z) Stm32F407ZET6

### Library data of the parts
C117-C119 = Capacitor-0
C122 C124-C135 = Capacitor
L10 = Ind
R101 R104 R106 = Resistor-0
R107 R108 = Resistor
U15 = STM32F407Z: Value: STM32F407ZGT6
U16 = Header 2X2: Header, 2-Pin, Dual row; LatestRevisionDate: 17-Jul-2002; LatestRevisionNote: Re-released for DXP Platform.; Publisher: Altium Limited

## Sheet W5500_1.SchDoc
size A4
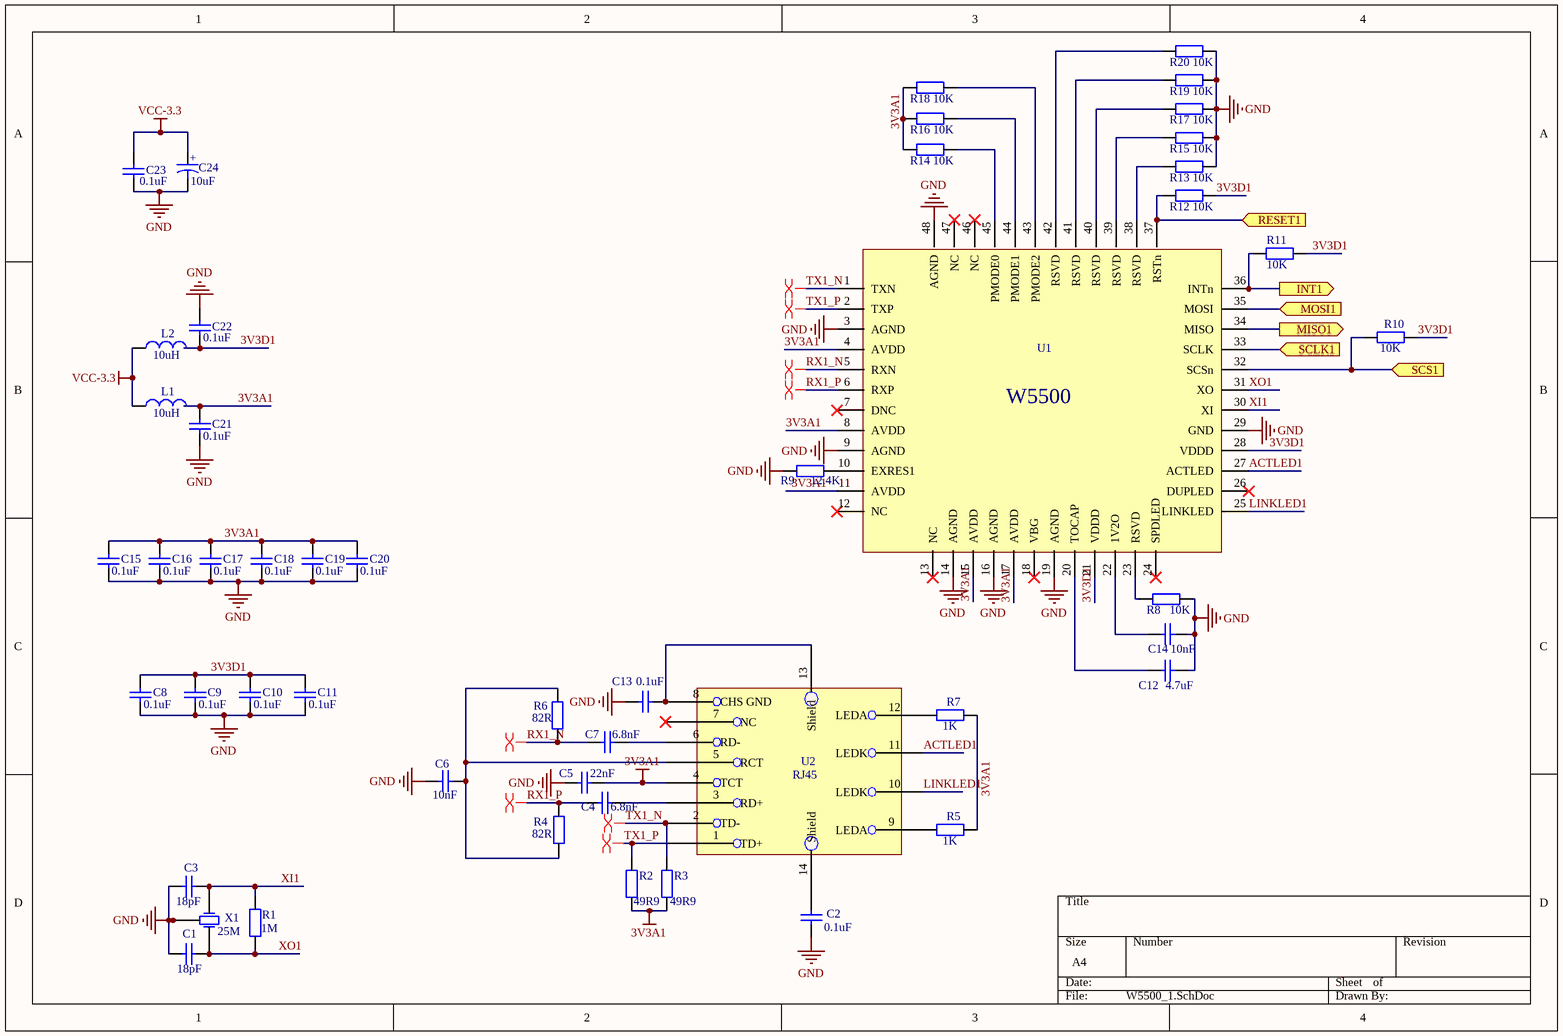
[diagram p5: W5500_1.SchDoc]

### Parts
C1  value 18pF  [0603]  (hidden comment: Capacitor-0603)
C2  value 0.1uF  [0603]  (hidden comment: Capacitor-0603)
C3  value 18pF  [0603]  (hidden comment: Capacitor-0603)
C4  value 6.8nF  [0603]  (hidden comment: Capacitor-0603)
C5  value 22nF  [0603]  (hidden comment: Capacitor-0603)
C6  value 10nF  [0603]  (hidden comment: Capacitor-0603)
C7  value 6.8nF  [0603]  (hidden comment: Capacitor-0603)
C8  value 0.1uF  [0603]  (hidden comment: Capacitor-0603)
C9  value 0.1uF  [0603]  (hidden comment: Capacitor-0603)
C10  value 0.1uF  [0603]  (hidden comment: Capacitor-0603)
C11  value 0.1uF  [0603]  (hidden comment: Capacitor-0603)
C12  value 4.7uF  [0603]  (hidden comment: Capacitor-0805)
C13  value 0.1uF  [0603]  (hidden comment: Capacitor-0603)
C14  value 10nF  [0603]  (hidden comment: Capacitor-0603)
C15  value 0.1uF  [0603]  (hidden comment: Capacitor-0603)
C16  value 0.1uF  [0603]  (hidden comment: Capacitor-0603)
C17  value 0.1uF  [0603]  (hidden comment: Capacitor-0603)
C18  value 0.1uF  [0603]  (hidden comment: Capacitor-0603)
C19  value 0.1uF  [0603]  (hidden comment: Capacitor-0603)
C20  value 0.1uF  [0603]  (hidden comment: Capacitor-0603)
C21  value 0.1uF  [0603]  (hidden comment: Capacitor-0603)
C22  value 0.1uF  [0603]  (hidden comment: Capacitor-0603)
C23  value 0.1uF  [0603]  (hidden comment: Capacitor-0603)
C24  value 10uF  [钽电容1206（A3216）]  (hidden comment: 电解电容)
L1  value 10uH  [0805]  (hidden comment: Inductor)
L2  value 10uH  [0805]  (hidden comment: Inductor)
R1  value 1M  [0603]  (hidden comment: Resistor-0603)
R2  value 49R9  [0603]  (hidden comment: Resistor-0603)
R3  value 49R9  [0603]  (hidden comment: Resistor-0603)
R4  value 82R  [0603]  (hidden comment: Resistor-0603)
R5  value 1K  [0603]  (hidden comment: Resistor-0603)
R6  value 82R  [0603]  (hidden comment: Resistor-0603)
R7  value 1K  [0603]  (hidden comment: Resistor-0603)
R8  value 10K  [0603]  (hidden comment: Resistor-0603)
R9  value 12.4K  [0603]  (hidden comment: Resistor-0603)
R10  value 10K  [0603]  (hidden comment: Resistor-0603)
R11  value 10K  [0603]  (hidden comment: Resistor-0603)
R12  value 10K  [0603]  (hidden comment: Resistor-0603)
R13  value 10K  [0603]  (hidden comment: Resistor-0603)
R14  value 10K  [0603]  (hidden comment: Resistor-0603)
R15  value 10K  [0603]  (hidden comment: Resistor-0603)
R16  value 10K  [0603]  (hidden comment: Resistor-0603)
R17  value 10K  [0603]  (hidden comment: Resistor-0603)
R18  value 10K  [0603]  (hidden comment: Resistor-0603)
R19  value 10K  [0603]  (hidden comment: Resistor-0603)
R20  value 10K  [0603]  (hidden comment: Resistor-0603)
U1  W5500  [W5500]  (value not drawn)
U2  RJ45  [RJ45]
X1  value 25M  [3225无源晶振]  (hidden comment: 3225无源晶振)

### Ports
INT1 (out), MISO1 (out), MOSI1 (in), RESET1 (in), SCLK1 (in), SCS1 (in)

### Nets
3V3A1: C5.2 C15.1 C16.1 C17.1 C18.1 C19.1 C20.1 C21.1 L1.2 R2.2 R3.2 R5.2 R7.2 R14.2 R16.2 R18.2 U1.4(AVDD) U1.8(AVDD) U1.11(AVDD) U1.15(AVDD) U1.17(AVDD) U2.4(TCT)
GND: C1.1 C2.2 C3.1 C5.1 C6.1 C8.2 C9.2 C10.2 C11.2 C12.2 C13.2 C14.1 C15.2 C16.2 C17.2 C18.2 C19.2 C20.2 C21.2 C22.2 C23.1 C24.1 R8.1 R9.2 R13.1 R15.1 R17.1 R19.1 R20.1 U1.3(AGND) U1.9(AGND) U1.14(AGND) U1.16(AGND) U1.19(AGND) U1.29(GND) U1.48(AGND) X1.2(GND) X1.4(GND)
VCC-3.3: C23.2 C24.2 L1.1 L2.1
3V3D1: C8.1 C9.1 C10.1 C11.1 C22.1 L2.2 R10.2 R11.2 R12.1 U1.21(VDDD) U1.28(VDDD)
ACTLED1: U1.27(ACTLED) U2.11(LEDK)
LINKLED1: U1.25(LINKLED) U2.10(LEDK)
RX1_N: C7.1 R6.2 U1.5(RXN)
RX1_P: C4.1 R4.1 U1.6(RXP)
SPI2_CLK: U1.33(SCLK) ; port SCLK1
SPI2_MISO: U1.34(MISO) ; port MISO1
SPI2_MOSI: U1.35(MOSI) ; port MOSI1
SPI2_NSS: R10.1 U1.32(SCSn) ; port SCS1
TX1_N: R3.1 U1.1(TXN) U2.2(TD-)
TX1_P: R2.1 U1.2(TXP) U2.1(TD+)
XI1: C3.2 R1.1 U1.30(XI) X1.1(OSC1)
XO1: C1.2 R1.2 U1.31(XO) X1.3(OSC2)
NetC2_1: C2.1 U2.14(Shield)
NetC4_2: C4.2 U2.3(RD+)
NetC6_2: C6.2 R4.2 R6.1 U2.5(RCT)
NetC7_2: C7.2 U2.6(RD-)
NetC12_1: C12.1 U1.20(TOCAP)
NetC13_1: C13.1 U2.8(CHS_GND) U2.13(Shield)
NetC14_2: C14.2 U1.22(1V2O)
NetR5_1: R5.1 U2.9(LEDA)
NetR7_1: R7.1 U2.12(LEDA)
NetR8_2: R8.2 U1.23(RSVD)
NetR9_1: R9.1 U1.10(EXRES1)
NetR11_1: R11.1 U1.36(INTn) ; port INT1
NetR12_2: R12.2 U1.37(RSTn) ; port RESET1
NetR13_2: R13.2 U1.38(RSVD)
NetR14_1: R14.1 U1.45(PMODE0)
NetR15_2: R15.2 U1.39(RSVD)
NetR16_1: R16.1 U1.44(PMODE1)
NetR17_2: R17.2 U1.40(RSVD)
NetR18_1: R18.1 U1.43(PMODE2)
NetR19_2: R19.2 U1.41(RSVD)
NetR20_2: R20.2 U1.42(RSVD)

Not connected (* = marked no-connect by the designer): U1 7(DNC)* 12(NC)* 13(NC)* 18(VBG)* 24(SPDLED)* 26(DUPLED)* 46(NC)* 47(NC)*; U2 7(NC)*

### Layout directives
differential pair: RX1_N, RX1_P, TX1_N, TX1_P

### Notes on the sheet
- (in symbol 电解电容) +

### Library data of the parts
U1 = W5500: Name: W5500
U2 = RJ45: Name: RJ45

## Sheet W5500_2.SchDoc
size A4
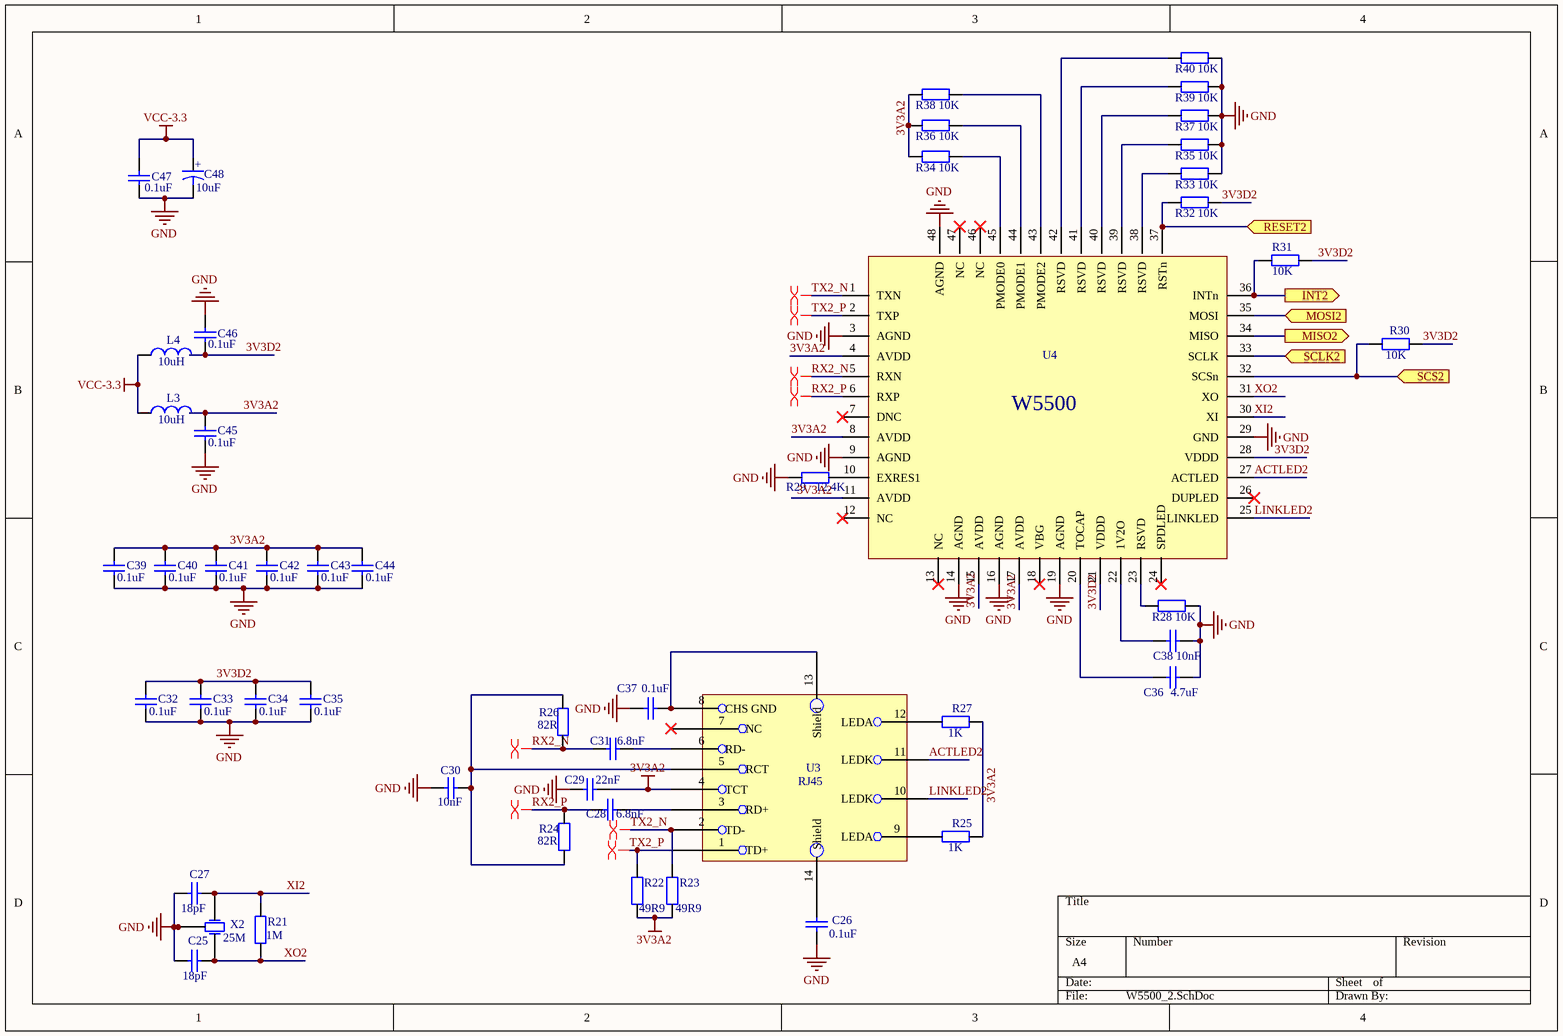
[diagram p6: W5500_2.SchDoc]

### Parts
C25  value 18pF  [0603]  (hidden comment: Capacitor-0603)
C26  value 0.1uF  [0603]  (hidden comment: Capacitor-0603)
C27  value 18pF  [0603]  (hidden comment: Capacitor-0603)
C28  value 6.8nF  [0603]  (hidden comment: Capacitor-0603)
C29  value 22nF  [0603]  (hidden comment: Capacitor-0603)
C30  value 10nF  [0603]  (hidden comment: Capacitor-0603)
C31  value 6.8nF  [0603]  (hidden comment: Capacitor-0603)
C32  value 0.1uF  [0603]  (hidden comment: Capacitor-0603)
C33  value 0.1uF  [0603]  (hidden comment: Capacitor-0603)
C34  value 0.1uF  [0603]  (hidden comment: Capacitor-0603)
C35  value 0.1uF  [0603]  (hidden comment: Capacitor-0603)
C36  value 4.7uF  [0603]  (hidden comment: Capacitor-0805)
C37  value 0.1uF  [0603]  (hidden comment: Capacitor-0603)
C38  value 10nF  [0603]  (hidden comment: Capacitor-0603)
C39  value 0.1uF  [0603]  (hidden comment: Capacitor-0603)
C40  value 0.1uF  [0603]  (hidden comment: Capacitor-0603)
C41  value 0.1uF  [0603]  (hidden comment: Capacitor-0603)
C42  value 0.1uF  [0603]  (hidden comment: Capacitor-0603)
C43  value 0.1uF  [0603]  (hidden comment: Capacitor-0603)
C44  value 0.1uF  [0603]  (hidden comment: Capacitor-0603)
C45  value 0.1uF  [0603]  (hidden comment: Capacitor-0603)
C46  value 0.1uF  [0603]  (hidden comment: Capacitor-0603)
C47  value 0.1uF  [0603]  (hidden comment: Capacitor-0603)
C48  value 10uF  [钽电容1206（A3216）]  (hidden comment: 电解电容)
L3  value 10uH  [0805]  (hidden comment: Inductor)
L4  value 10uH  [0805]  (hidden comment: Inductor)
R21  value 1M  [0603]  (hidden comment: Resistor-0603)
R22  value 49R9  [0603]  (hidden comment: Resistor-0603)
R23  value 49R9  [0603]  (hidden comment: Resistor-0603)
R24  value 82R  [0603]  (hidden comment: Resistor-0603)
R25  value 1K  [0603]  (hidden comment: Resistor-0603)
R26  value 82R  [0603]  (hidden comment: Resistor-0603)
R27  value 1K  [0603]  (hidden comment: Resistor-0603)
R28  value 10K  [0603]  (hidden comment: Resistor-0603)
R29  value 12.4K  [0603]  (hidden comment: Resistor-0603)
R30  value 10K  [0603]  (hidden comment: Resistor-0603)
R31  value 10K  [0603]  (hidden comment: Resistor-0603)
R32  value 10K  [0603]  (hidden comment: Resistor-0603)
R33  value 10K  [0603]  (hidden comment: Resistor-0603)
R34  value 10K  [0603]  (hidden comment: Resistor-0603)
R35  value 10K  [0603]  (hidden comment: Resistor-0603)
R36  value 10K  [0603]  (hidden comment: Resistor-0603)
R37  value 10K  [0603]  (hidden comment: Resistor-0603)
R38  value 10K  [0603]  (hidden comment: Resistor-0603)
R39  value 10K  [0603]  (hidden comment: Resistor-0603)
R40  value 10K  [0603]  (hidden comment: Resistor-0603)
U3  RJ45  [RJ45]
U4  W5500  [W5500]  (value not drawn)
X2  value 25M  [3225无源晶振]  (hidden comment: 3225无源晶振)

### Ports
INT2 (out), MISO2 (out), MOSI2 (in), RESET2 (in), SCLK2 (in), SCS2 (in)

### Nets
3V3A2: C29.2 C39.1 C40.1 C41.1 C42.1 C43.1 C44.1 C45.1 L3.2 R22.2 R23.2 R25.2 R27.2 R34.2 R36.2 R38.2 U3.4(TCT) U4.4(AVDD) U4.8(AVDD) U4.11(AVDD) U4.15(AVDD) U4.17(AVDD)
GND: C25.1 C26.2 C27.1 C29.1 C30.1 C32.2 C33.2 C34.2 C35.2 C36.2 C37.2 C38.1 C39.2 C40.2 C41.2 C42.2 C43.2 C44.2 C45.2 C46.2 C47.1 C48.1 R28.1 R29.2 R33.1 R35.1 R37.1 R39.1 R40.1 U4.3(AGND) U4.9(AGND) U4.14(AGND) U4.16(AGND) U4.19(AGND) U4.29(GND) U4.48(AGND) X2.2(GND) X2.4(GND)
VCC-3.3: C47.2 C48.2 L3.1 L4.1
3V3D2: C32.1 C33.1 C34.1 C35.1 C46.1 L4.2 R30.2 R31.2 R32.1 U4.21(VDDD) U4.28(VDDD)
ACTLED2: U3.11(LEDK) U4.27(ACTLED)
LINKLED2: U3.10(LEDK) U4.25(LINKLED)
RX2_N: C31.1 R26.2 U4.5(RXN)
RX2_P: C28.1 R24.1 U4.6(RXP)
SPI1_CLK: U4.33(SCLK) ; port SCLK2
SPI1_MISO: U4.34(MISO) ; port MISO2
SPI1_MOSI: U4.35(MOSI) ; port MOSI2
SPI1_NSS: R30.1 U4.32(SCSn) ; port SCS2
TX2_N: R23.1 U3.2(TD-) U4.1(TXN)
TX2_P: R22.1 U3.1(TD+) U4.2(TXP)
XI2: C27.2 R21.1 U4.30(XI) X2.1(OSC1)
XO2: C25.2 R21.2 U4.31(XO) X2.3(OSC2)
NetC26_1: C26.1 U3.14(Shield)
NetC28_2: C28.2 U3.3(RD+)
NetC30_2: C30.2 R24.2 R26.1 U3.5(RCT)
NetC31_2: C31.2 U3.6(RD-)
NetC36_1: C36.1 U4.20(TOCAP)
NetC37_1: C37.1 U3.8(CHS_GND) U3.13(Shield)
NetC38_2: C38.2 U4.22(1V2O)
NetR25_1: R25.1 U3.9(LEDA)
NetR27_1: R27.1 U3.12(LEDA)
NetR28_2: R28.2 U4.23(RSVD)
NetR29_1: R29.1 U4.10(EXRES1)
NetR31_1: R31.1 U4.36(INTn) ; port INT2
NetR32_2: R32.2 U4.37(RSTn) ; port RESET2
NetR33_2: R33.2 U4.38(RSVD)
NetR34_1: R34.1 U4.45(PMODE0)
NetR35_2: R35.2 U4.39(RSVD)
NetR36_1: R36.1 U4.44(PMODE1)
NetR37_2: R37.2 U4.40(RSVD)
NetR38_1: R38.1 U4.43(PMODE2)
NetR39_2: R39.2 U4.41(RSVD)
NetR40_2: R40.2 U4.42(RSVD)

Not connected (* = marked no-connect by the designer): U3 7(NC)*; U4 7(DNC)* 12(NC)* 13(NC)* 18(VBG)* 24(SPDLED)* 26(DUPLED)* 46(NC)* 47(NC)*

### Layout directives
differential pair: RX2_N, RX2_P, TX2_N, TX2_P

### Notes on the sheet
- (in symbol 电解电容) +

### Library data of the parts
U3 = RJ45: Name: RJ45
U4 = W5500: Name: W5500

## Nets that join several sheets
AFE_VCC: SM2200 (7 pins), Power (C141.2 R102.2 U17.2 U17.3)
GND: Module (24 pins), SM2200 (65 pins), Power (46 pins), MCU (35 pins), W5500_1 (38 pins), W5500_2 (38 pins)
VCC-3.3: Module (9 pins), Power (C91.1 C101.2 U7.1 U7.2), W5500_1 (C23.2 C24.2 L1.1 L2.1), W5500_2 (C47.2 C48.2 L3.1 L4.1)
VDD3.3: Power (7 pins), MCU (28 pins)
VDD-3.3: Module (5 pins), SM2200 (22 pins), Power (C93.1 C103.2 U8.1 U8.2)
INT: SM2200 (R52.1 U5.25), MCU (U15.34)
NetR11_1: MCU (U15.67), W5500_1 (R11.1 U1.36)
NetR12_2: MCU (U15.65), W5500_1 (R12.2 U1.37)
NetR31_1: MCU (U15.45), W5500_2 (R31.1 U4.36)
NetR32_2: MCU (U15.36), W5500_2 (R32.2 U4.37)
NetR74_2: Power (R74.2), MCU (U15.125)
NetR75_2: Power (R75.2), MCU (U15.92)
NetR79_2: Module (R79.2), MCU (U15.142)
NetR81_1: Module (R81.1), MCU (U15.102)
NetR82_1: Module (R82.1), MCU (U15.101)
NetR83_2: Module (R83.2), MCU (U15.140)
NetR84_2: Module (R84.2), MCU (U15.139)
NetR85_2: Module (R85.2), MCU (U15.141)
NetR86_2: Module (R86.2), MCU (U15.137)
NetR91_1: Module (R91.1), MCU (U15.77)
NetR94_2: Module (R94.2 U13.2 U13.3), MCU (U15.80)
NetR96_2: Module (R96.2 U14.5), MCU (U15.82)
NetR98_1: Module (R98.1), MCU (U15.78)
NetR100_2: Module (R100.2 U14.6), MCU (U15.81)
RST_SM2200: SM2200 (R51.1 U5.24), MCU (U15.35)
SPI1_CLK: MCU (U15.41), W5500_2 (U4.33)
SPI1_MISO: MCU (U15.42), W5500_2 (U4.34)
SPI1_MOSI: MCU (U15.43), W5500_2 (U4.35)
SPI1_NSS: MCU (U15.40), W5500_2 (R30.1 U4.32)
SPI2_CLK: MCU (U15.74), W5500_1 (U1.33)
SPI2_MISO: MCU (U15.75), W5500_1 (U1.34)
SPI2_MOSI: MCU (U15.76), W5500_1 (U1.35)
SPI2_NSS: MCU (U15.73), W5500_1 (R10.1 U1.32)
SPI3_CLK: SM2200 (U5.35), MCU (U15.111)
SPI3_MISO: SM2200 (U5.33), MCU (U15.112)
SPI3_MOSI: SM2200 (U5.34), MCU (U15.113)
SPI3_NSS: SM2200 (U5.36), MCU (U15.114)